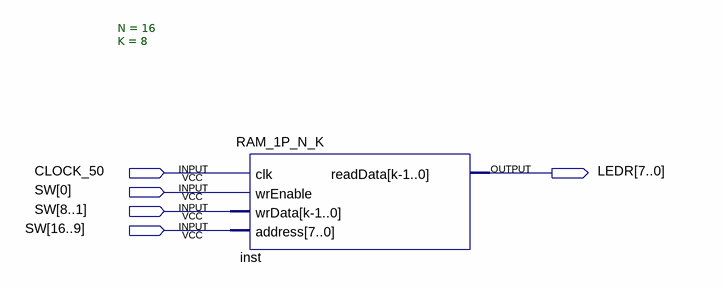
[diagram p0: schematic sheet]
// Quartus schematic RAM_1P_Par_Demo.bdf as structural Verilog: 1 symbols, 5 pins
module RAM_1P_Par_Demo (
  input  CLOCK_50,
  input  [16:0] SW,
  output [7:0] LEDR
);

  RAM_1P_N_K #(.N(16), .K(8)) inst (
    .clk(CLOCK_50), .wrEnable(SW[0]), .wrData(SW[8:1]), .address(SW[16:9]), .readData(LEDR));
endmodule
